# Altium schematic sheet Connectors.SchDoc: Connectors and IO
size A; DocumentNumber: 6; SheetNumber: 6; SheetTotal: 9
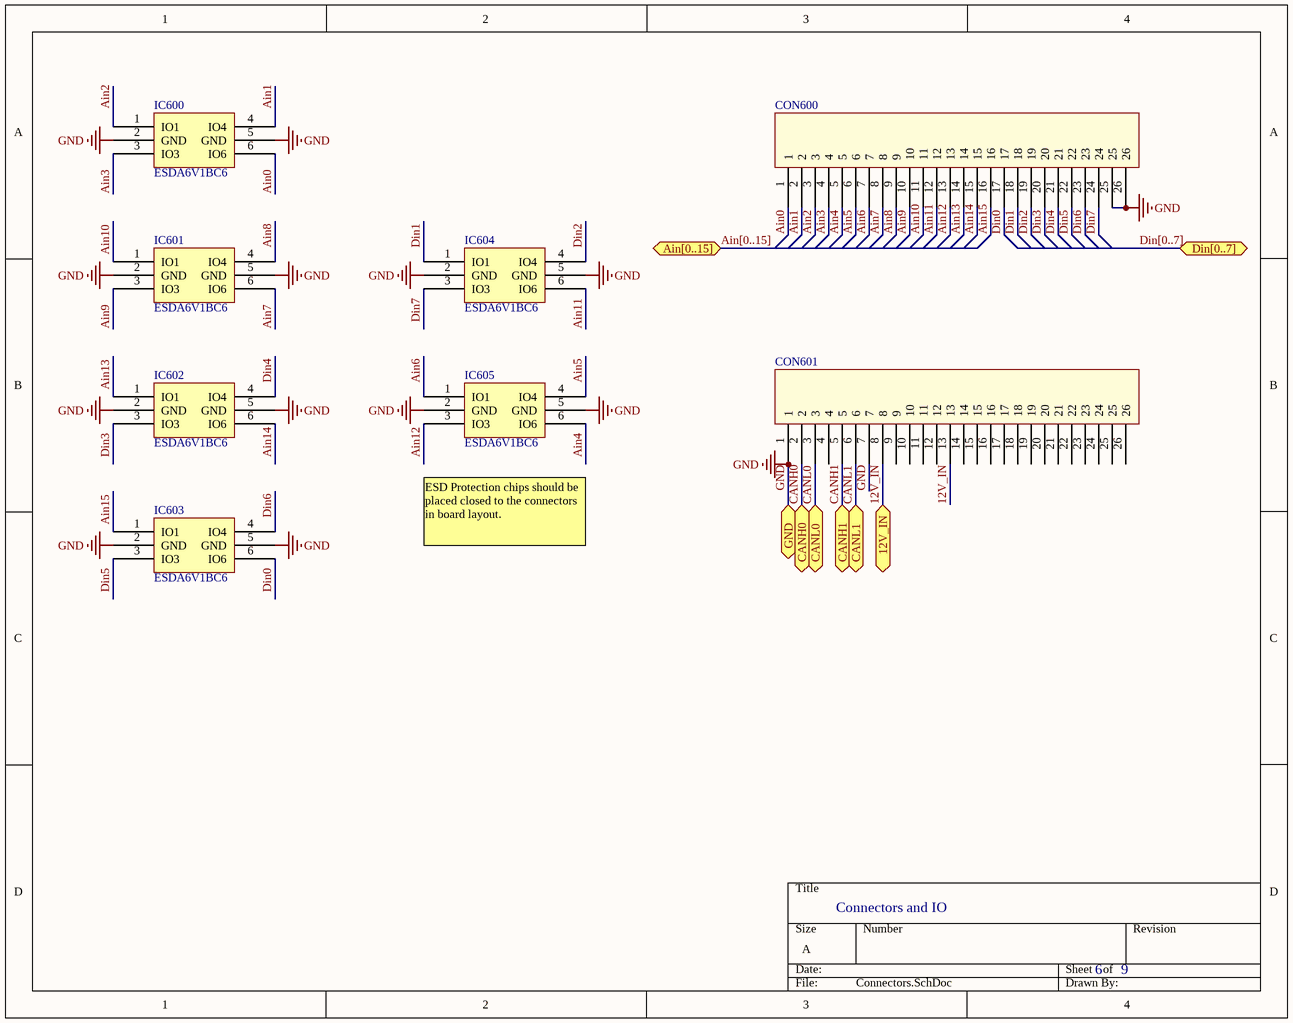
[diagram p0: Connectors.SchDoc]

## Parts
CON600  26 Pin Conn  [AMP SuperSeal 1.0 26pin]  (value not drawn)
CON601  26 Pin Conn  [AMP SuperSeal 1.0 26pin]  (value not drawn)
IC600  ESDA6V1BC6  [SOT23-6L]
IC601  ESDA6V1BC6  [SOT23-6L]
IC602  ESDA6V1BC6  [SOT23-6L]
IC603  ESDA6V1BC6  [SOT23-6L]
IC604  ESDA6V1BC6  [SOT23-6L]
IC605  ESDA6V1BC6  [SOT23-6L]

## Ports
12V_IN, Ain[0..15], CANH0, CANH1, CANL0, CANL1, Din[0..7], GND

## Nets
GND: CON600.25 CON600.26 CON601.1 CON601.7 IC600.2(GND) IC600.5(GND) IC601.2(GND) IC601.5(GND) IC602.2(GND) IC602.5(GND) IC603.2(GND) IC603.5(GND) IC604.2(GND) IC604.5(GND) IC605.2(GND) IC605.5(GND) ; port GND
12V_IN: CON601.8 CON601.13 ; port 12V_IN
Ain0: CON600.1 IC600.6(IO6)
Ain1: CON600.2 IC600.4(IO4)
Ain2: CON600.3 IC600.1(IO1)
Ain3: CON600.4 IC600.3(IO3)
Ain4: CON600.5 IC605.6(IO6)
Ain5: CON600.6 IC605.4(IO4)
Ain6: CON600.7 IC605.1(IO1)
Ain7: CON600.8 IC601.6(IO6)
Ain8: CON600.9 IC601.4(IO4)
Ain9: CON600.10 IC601.3(IO3)
Ain10: CON600.11 IC601.1(IO1)
Ain11: CON600.12 IC604.6(IO6)
Ain12: CON600.13 IC605.3(IO3)
Ain13: CON600.14 IC602.1(IO1)
Ain14: CON600.15 IC602.6(IO6)
Ain15: CON600.16 IC603.1(IO1)
CANH0: CON601.2 ; port CANH0
CANH1: CON601.5 ; port CANH1
CANL0: CON601.3 ; port CANL0
CANL1: CON601.6 ; port CANL1
Din0: CON600.17 IC603.6(IO6)
Din1: CON600.18 IC604.1(IO1)
Din2: CON600.19 IC604.4(IO4)
Din3: CON600.20 IC602.3(IO3)
Din4: CON600.21 IC602.4(IO4)
Din5: CON600.22 IC603.3(IO3)
Din6: CON600.23 IC603.4(IO4)
Din7: CON600.24 IC604.3(IO3)

Not connected (* = marked no-connect by the designer): CON601 4 9 10 11 12 14 15 16 17 18 19 20 21 22 23 24 25 26

## Buses and harness runs
bus Ain[0..15] = port Ain[0..15]
bus Din[0..7] = port Din[0..7]

## Notes on the sheet
- ESD Protection chips should be placed closed to the connectors in board layout.

## Library data of the parts
CON600 CON601 = AMP_26Pin: AMP SuperSeal 1.0 26 Pin
IC600-IC605 = ESDA6V1BC6: 4 channel bi directional ESD protection